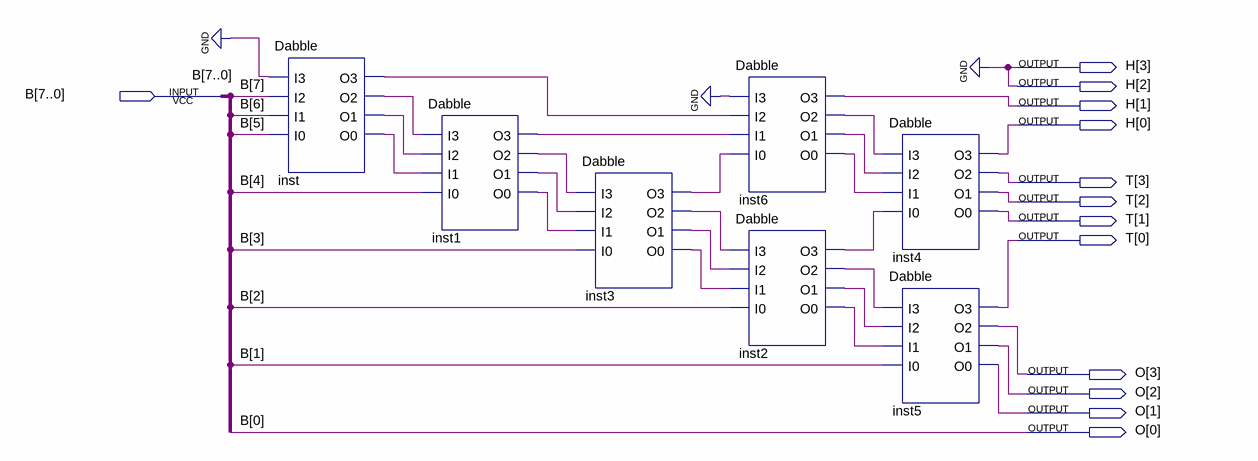
[diagram p0: schematic sheet]
// Quartus schematic DOUBLE_DABBLE.bdf as structural Verilog: 7 symbols, 13 pins
module DOUBLE_DABBLE (
  input  [7:0] B,
  output [3:0] H,
  output [3:0] T,
  output [3:0] O
);

  wire inst1_o0, inst1_o1, inst1_o2, inst1_o3, inst2_o0, inst2_o1, inst2_o2, inst2_o3, inst3_o0, inst3_o1,
       inst3_o2, inst3_o3, inst6_o0, inst6_o1, inst6_o2, inst_o0, inst_o1, inst_o2, inst_o3;

  Dabble inst (.I3(1'b0), .I2(B[7]), .I1(B[6]), .I0(B[5]), .O3(inst_o3), .O2(inst_o2), .O1(inst_o1), .O0(inst_o0));
  Dabble inst1 (
    .I3(inst_o2), .I2(inst_o1), .I1(inst_o0), .I0(B[4]), .O3(inst1_o3), .O2(inst1_o2), .O1(inst1_o1),
    .O0(inst1_o0));
  Dabble inst3 (
    .I3(inst1_o2), .I2(inst1_o1), .I1(inst1_o0), .I0(B[3]), .O3(inst3_o3), .O2(inst3_o2), .O1(inst3_o1),
    .O0(inst3_o0));
  Dabble inst6 (
    .I3(1'b0), .I2(inst_o3), .I1(inst1_o3), .I0(inst3_o3), .O3(H[1]), .O2(inst6_o2), .O1(inst6_o1),
    .O0(inst6_o0));
  Dabble inst2 (
    .I3(inst3_o2), .I2(inst3_o1), .I1(inst3_o0), .I0(B[2]), .O3(inst2_o3), .O2(inst2_o2), .O1(inst2_o1),
    .O0(inst2_o0));
  Dabble inst4 (.I3(inst6_o2), .I2(inst6_o1), .I1(inst6_o0), .I0(inst2_o3), .O3(H[0]), .O2(T[3]), .O1(T[2]), .O0(T[1]));
  Dabble inst5 (.I3(inst2_o2), .I2(inst2_o1), .I1(inst2_o0), .I0(B[1]), .O3(T[0]), .O2(O[3]), .O1(O[2]), .O0(O[1]));

  assign H[3:2] = 2'b00;
  assign O[0] = B[0];
endmodule
